# EAGLE design DB9-Breakout (EAGLE 9.5.2)
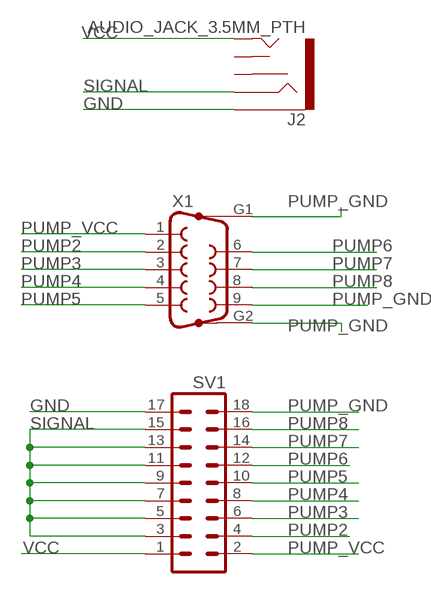
[diagram p0: schematic, sheet 1]

## Parts
J2  AUDIO_JACK_3.5MM_PTH  [AUDIO-JACK]
SV1  MA09-2  [MA09-2]
X1  F09HP  [F09HP]

## Nets
GND: J2.SLEEVE SV1.17
PUMP2: SV1.4 X1.2
PUMP3: SV1.6 X1.3
PUMP4: SV1.8 X1.4
PUMP5: SV1.10 X1.5
PUMP6: SV1.12 X1.6
PUMP7: SV1.14 X1.7
PUMP8: SV1.16 X1.8
PUMP_GND: SV1.18 X1.9 X1.G1 X1.G2
PUMP_VCC: SV1.2 X1.1
SIGNAL: J2.RING SV1.3 SV1.5 SV1.7 SV1.9 SV1.11 SV1.13 SV1.15
VCC: J2.TIP SV1.1
Unconnected: J2.RSH J2.TSH

## Library data of the parts
J2 = SparkFun-Connectors:AUDIO_JACK_3.5MM: Audio Jack 3.5mm variants of PTH and SMT stereo audio jack with bypass switches. SparkFun Products: SparkFun SparkPunk Sound Kit <[https://www.sparkfun.com/products/11177]> - PTH MP3 Trigger <https://www.sparkfun.com/products/13720> -3.5mm SMD SparkFun PicoBoard <https://www.sparkfun.com/products/11888>- 2.5mm SMD; PROD_ID: CONN-08774; SF_ID: PRT-08032
SV1 = con-lstb-mod:MA09-2: PIN HEADER; OC_FARNELL: unknown; OC_NEWARK: unknown
X1 = con-subd:F09HP: SUB-D; OC_FARNELL: unknown; OC_NEWARK: unknown

## Board
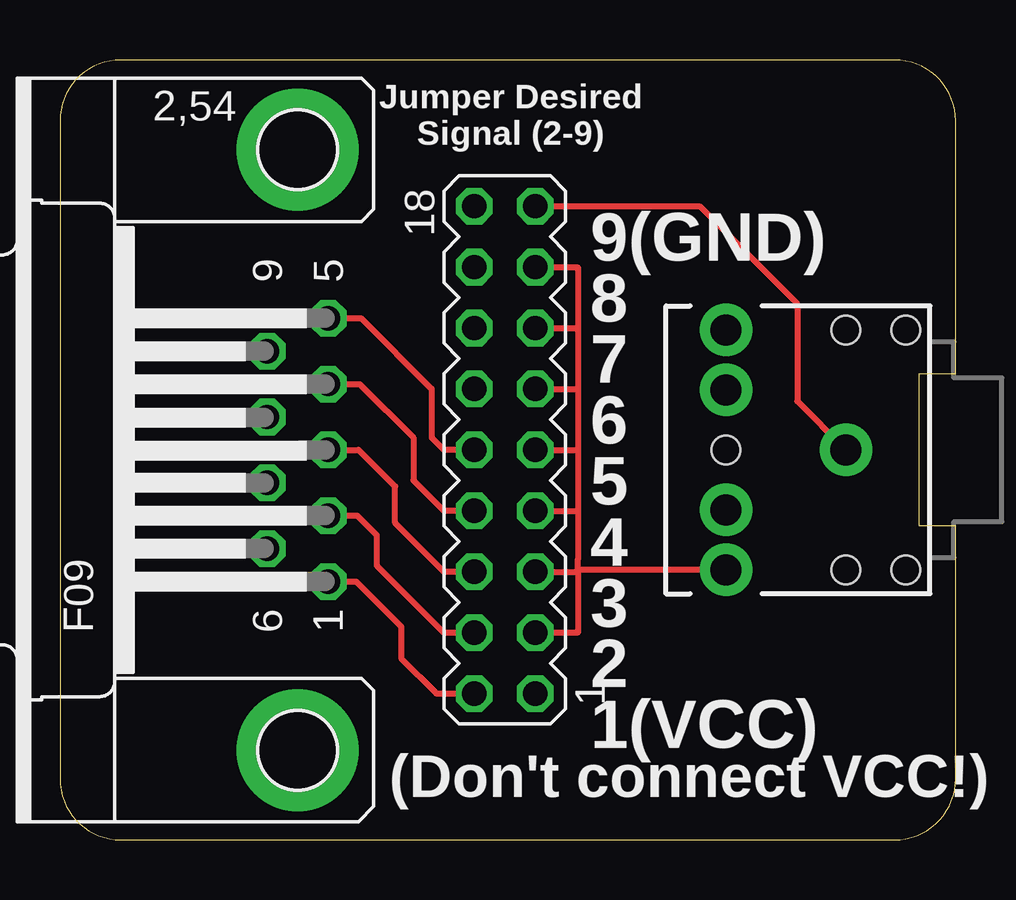
[diagram p1: board, top side]
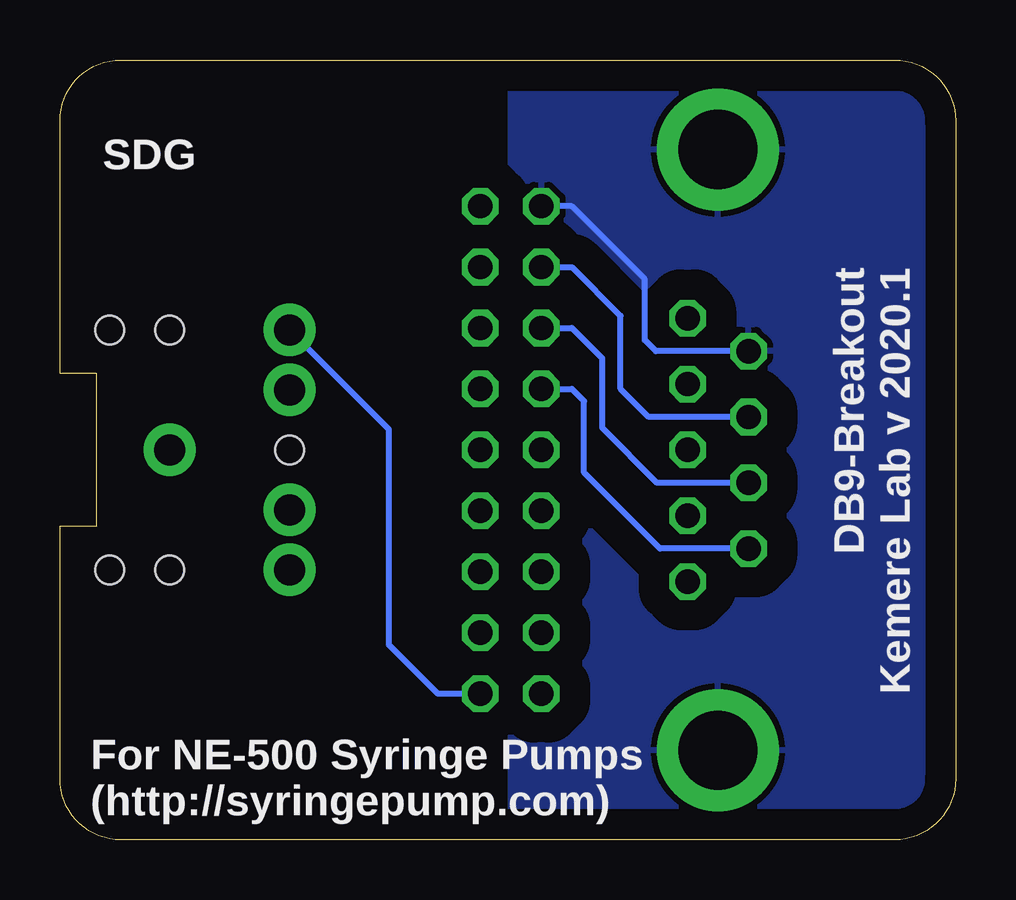
[diagram p2: board, bottom side, seen from below]

Size 37.34 x 32.51 mm. Coordinates in mm from the lower left corner, seen from the top.
Outline: 34.8,32.51 2.54,32.51 arc90 0,29.97 0,2.54 arc90 2.54,0 34.8,0 arc90 37.34,2.54 37.34,13.08 35.81,13.08 35.81,19.43 37.34,19.43 37.34,29.97 arc90 34.8,32.51
Copper layers (1*16): Top 0.035mm / dielectric 1.5mm / Bottom 0.035mm
Design rules "adafruit": minimum track width 8mil, minimum drill 15.5mil, track to track 8mil, track to pad 8mil, pad to pad 8mil, via to via 8mil, smd to smd 8mil, copper to edge 10mil, drill to drill 8mil, minimum pad ring 10mil, minimum via ring 8mil, stop-mask expansion 2mil, vias tented up to drill 20mil, thermal gap 10mil

### Footprints (pad centres in the part's own frame; a part is rotated, then mirrored left to right if it is on the bottom)
AUDIO-JACK = drill 1.3 pad 2.184: RING 5,5; RSH 5,2.5; SLEEVE 0,0; TIP 5,-5; TSH 5,-2.5 | hole 1.2: 0,5; -2.5,5; -2.5,-5; 0,-5; 5,0
MA09-2 = drill 1.016 octagon: 1 -10.16,-1.27; 2 -10.16,1.27; 3 -7.62,-1.27; 4 -7.62,1.27; 5 -5.08,-1.27; 6 -5.08,1.27; 7 -2.54,-1.27; 8 -2.54,1.27; 9 0,-1.27; 10 0,1.27; 11 2.54,-1.27; 12 2.54,1.27; 13 5.08,-1.27; 14 5.08,1.27; 15 7.62,-1.27; 16 7.62,1.27; 17 10.16,-1.27; 18 10.16,1.27
F09HP = drill 1.016 octagon: 1 -5.486,-1.27; 2 -2.743,-1.27; 3 0,-1.27; 4 2.743,-1.27; 5 5.486,-1.27; 6 -4.115,1.27; 7 -1.372,1.27; 8 1.372,1.27; 9 4.115,1.27 | drill 3.302 pad 5.08: G1 -12.522,0; G2 12.522,0

### Placement (x,y rotation side)
J2  32.77,16.26 180 top
SV1  18.54,16.26 90 top
X1  9.91,16.26 90 top

### Tracks (layer width: path | path; a pad name or v marks a point on that pad's centre or on a via)
GND
  Top 0.254: SV1.17 26.67,26.42 30.73,22.35 30.73,18.29 J2.SLEEVE
PUMP2
  Top 0.254: SV1.4 16,8.64 13.21,11.43 13.21,12.7 12.39,13.51 X1.2
PUMP3
  Top 0.254: SV1.6 16,11.18 13.97,13.21 13.97,14.73 12.45,16.26 X1.3
PUMP4
  Top 0.254: SV1.8 16,13.72 14.73,14.99 14.73,16.76 12.5,19 X1.4
PUMP5
  Top 0.254: SV1.10 16,16.26 15.49,16.76 15.49,18.8 12.55,21.74 X1.5
PUMP6
  Bottom 0.254: SV1.12 16,18.8 15.49,18.29 15.49,15.31 12.32,12.14 X1.6
PUMP7
  Bottom 0.254: SV1.14 16,21.34 14.73,20.07 14.73,17.17 12.45,14.88 X1.7
PUMP8
  Bottom 0.254: SV1.16 16,23.88 13.97,21.84 13.97,18.8 12.8,17.63 X1.8
PUMP_GND
  Bottom 0.254: SV1.18 16,26.42 12.95,23.37 12.95,20.83 12.5,20.37 X1.9
  pour Bottom (isolate 1.27): 0,0 18.54,0 18.54,32.51 0,32.51
PUMP_VCC
  Top 0.254: SV1.2 15.69,6.1 14.22,7.56 14.22,8.89 12.34,10.77 X1.1
SIGNAL
  Top 0.254: SV1.15 21.59,23.88 21.59,21.34 | 21.59,21.34 21.59,18.8 | 21.59,18.8 21.59,16.26 | 21.59,16.26 21.59,13.72 | 21.59,13.72 21.59,11.68 21.59,11.26 | 21.59,11.26 21.59,11.18 | 21.59,11.18 21.59,8.64 SV1.3 | SV1.7 21.59,13.72 | SV1.9 21.59,16.26 | SV1.11 21.59,18.8 | SV1.13 21.59,21.34 | SV1.5 21.59,11.18 | J2.RING 21.59,11.26
VCC
  Bottom 0.254: SV1.1 21.59,6.1 23.62,8.13 23.62,17.11 J2.TIP

### Text on the board
tPlace: Jumper Desired / Signal (2-9) | 9(GND) / 8 / 7 / 6 / 5 / 4 / 3 / 2 / 1(VCC) | (Don't connect VCC!)
bPlace: SDG | DB9-Breakout / Kemere Lab v 2020.1 | For NE-500 Syringe Pumps / (http://syringepump.com)